# EAGLE design BUS_OUT (EAGLE 9.6.2)
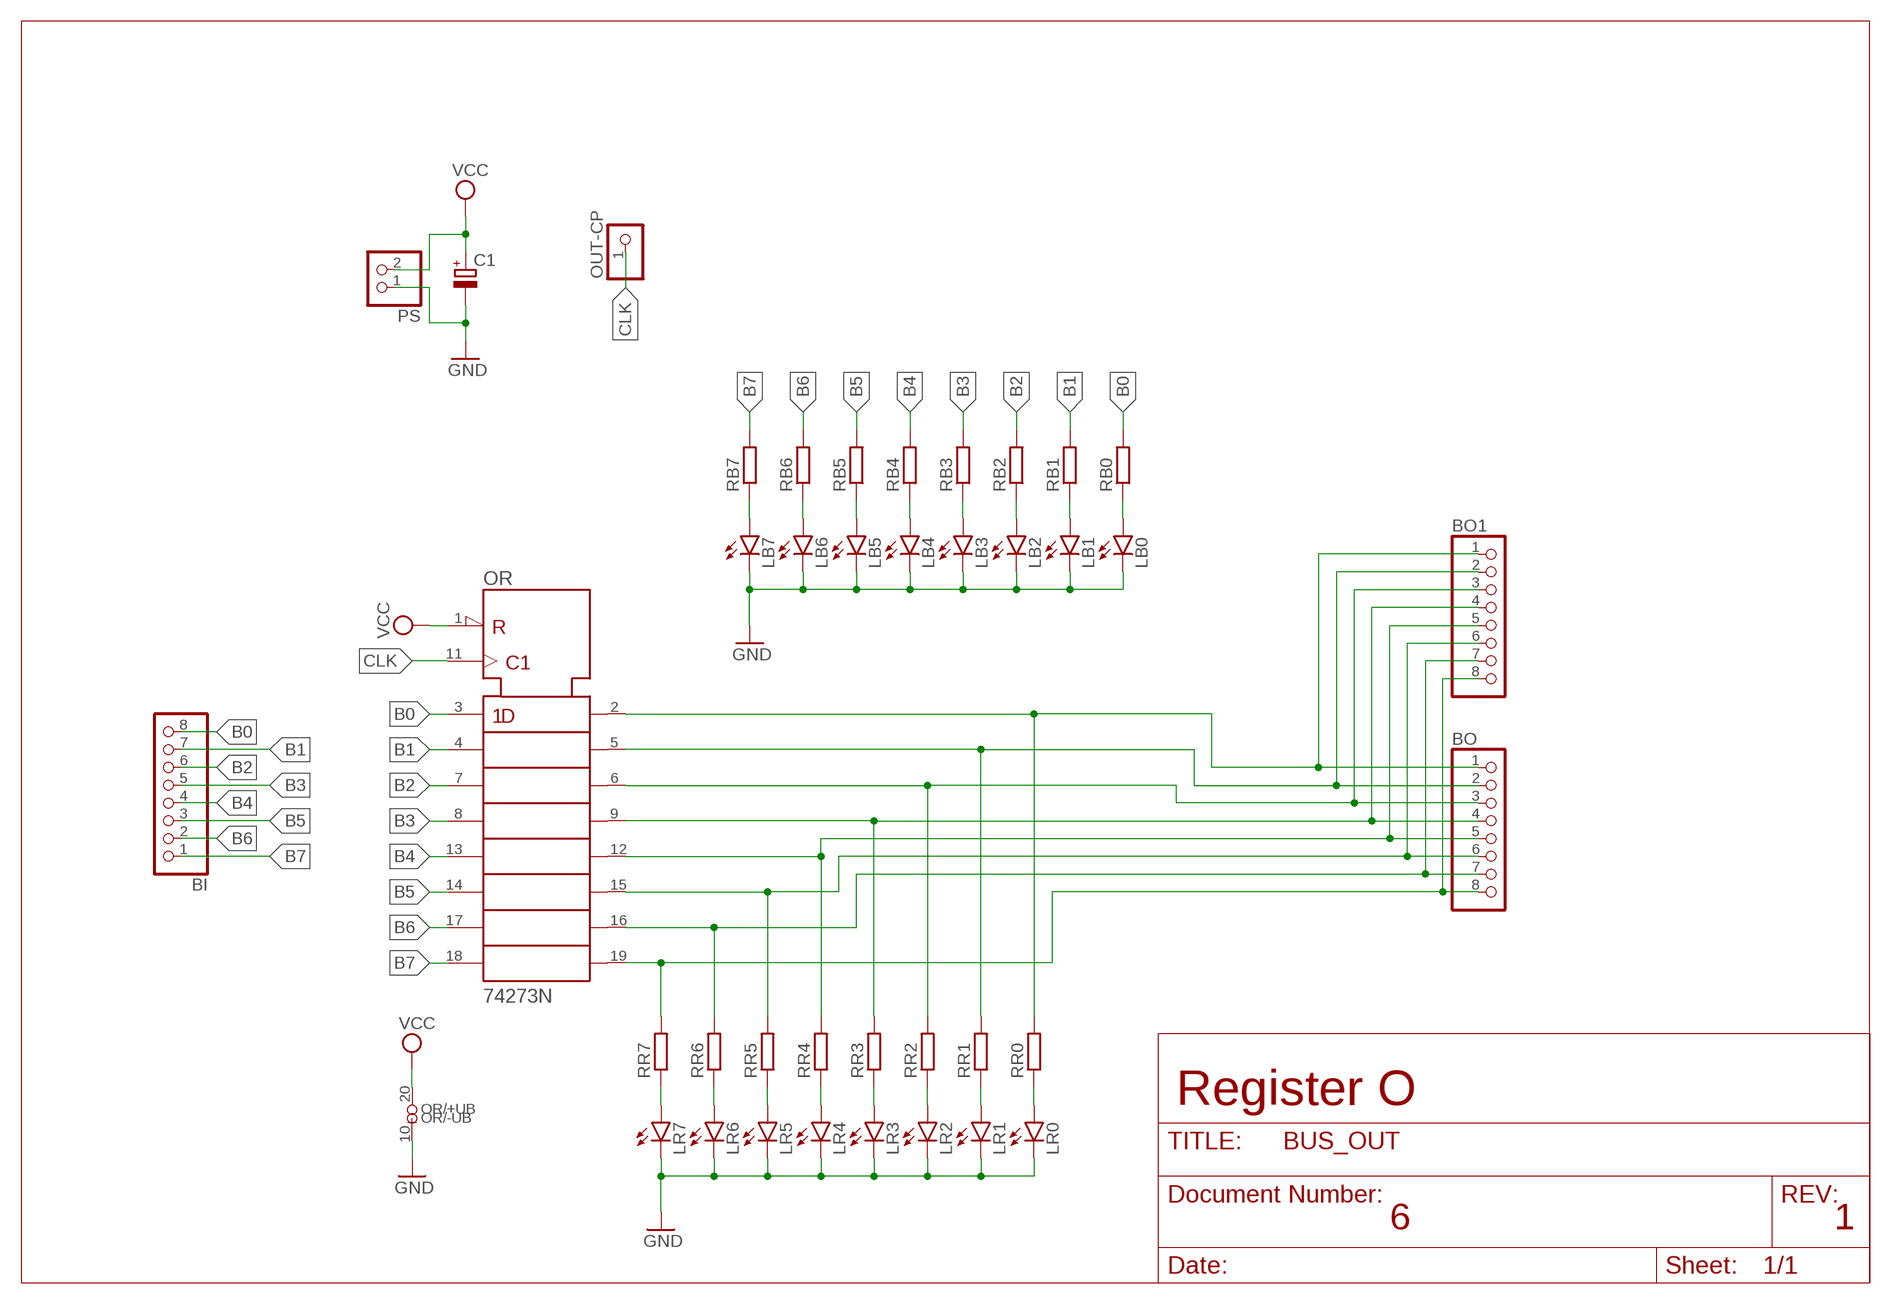
[diagram p0: schematic, sheet 1]

## Parts
BI  PINHD-1X8  [1X08]
BO  PINHD-1X8  [1X08]
BO1  PINHD-1X8  [1X08]
C1  CPOL-EUE2.5-6  [E2,5-6]
LB0  LED5MM  [LED5MM]
LB1  LED5MM  [LED5MM]
LB2  LED5MM  [LED5MM]
LB3  LED5MM  [LED5MM]
LB4  LED5MM  [LED5MM]
LB5  LED5MM  [LED5MM]
LB6  LED5MM  [LED5MM]
LB7  LED5MM  [LED5MM]
LR0  LED5MM  [LED5MM]
LR1  LED5MM  [LED5MM]
LR2  LED5MM  [LED5MM]
LR3  LED5MM  [LED5MM]
LR4  LED5MM  [LED5MM]
LR5  LED5MM  [LED5MM]
LR6  LED5MM  [LED5MM]
LR7  LED5MM  [LED5MM]
OR  74273N  [DIL20]
OUT-CP  PINHD-1X1  [1X01]
PS  PINHD-1X2  [1X02]
RB0  R-EU_0204/7  [0204/7]
RB1  R-EU_0204/7  [0204/7]
RB2  R-EU_0204/7  [0204/7]
RB3  R-EU_0204/7  [0204/7]
RB4  R-EU_0204/7  [0204/7]
RB5  R-EU_0204/7  [0204/7]
RB6  R-EU_0204/7  [0204/7]
RB7  R-EU_0204/7  [0204/7]
RR0  R-EU_0204/7  [0204/7]
RR1  R-EU_0204/7  [0204/7]
RR2  R-EU_0204/7  [0204/7]
RR3  R-EU_0204/7  [0204/7]
RR4  R-EU_0204/7  [0204/7]
RR5  R-EU_0204/7  [0204/7]
RR6  R-EU_0204/7  [0204/7]
RR7  R-EU_0204/7  [0204/7]

## Nets
B0: BI.8 OR.3(1D) RB0.2
B1: BI.7 OR.4(2D) RB1.2
B2: BI.6 OR.7(3D) RB2.2
B3: BI.5 OR.8(4D) RB3.2
B4: BI.4 OR.13(5D) RB4.2
B5: BI.3 OR.14(6D) RB5.2
B6: BI.2 OR.17(7D) RB6.2
B7: BI.1 OR.18(8D) RB7.2
CLK: OR.11(CLK) OUT-CP.1
GND: C1.- LB0.K(C) LB1.K(C) LB2.K(C) LB3.K(C) LB4.K(C) LB5.K(C) LB6.K(C) LB7.K(C) LR0.K(C) LR1.K(C) LR2.K(C) LR3.K(C) LR4.K(C) LR5.K(C) LR6.K(C) LR7.K(C) OR.10(-UB) PS.1
N$1: LB7.A RB7.1
N$3: LB6.A RB6.1
N$5: LB5.A RB5.1
N$7: LB4.A RB4.1
N$9: LR7.A RR7.1
N$10: LB3.A RB3.1
N$11: BO1.8 BO.8 OR.19(8Q) RR7.2
N$12: LR6.A RR6.1
N$14: BO1.7 BO.7 OR.16(7Q) RR6.2
N$15: LR5.A RR5.1
N$16: LB2.A RB2.1
N$17: BO1.6 BO.6 OR.15(6Q) RR5.2
N$18: LR4.A RR4.1
N$20: BO1.5 BO.5 OR.12(5Q) RR4.2
N$21: LR3.A RR3.1
N$22: LB1.A RB1.1
N$23: BO1.4 BO.4 OR.9(4Q) RR3.2
N$24: LR2.A RR2.1
N$26: BO1.3 BO.3 OR.6(3Q) RR2.2
N$27: LR1.A RR1.1
N$28: LB0.A RB0.1
N$29: BO1.2 BO.2 OR.5(2Q) RR1.2
N$30: LR0.A RR0.1
N$32: BO1.1 BO.1 OR.2(1Q) RR0.2
VCC: C1.+ OR.1(!CLR) OR.20(+UB) PS.2

## Notes on the sheet
- Register O
- 6 | 1

## Library data of the parts
BI BO BO1 = pinhead:PINHD-1X8: PIN HEADER
C1 = rcl:CPOL-EU: POLARIZED CAPACITOR, European symbol; SPICEPREFIX: C
LB0 LB1-LB7 LR0 LR1-LR7 = led:LED: LED OSRAM: - CHIPLED LG R971, LG N971, LY N971, LG Q971, LY Q971, LO R971, LY R971 LH N974, LH R974 LS Q976, LO Q976, LY Q976 LO Q996 - Hyper CHIPLED LW Q18S LB Q993, LB Q99A, LB R99A - SideLED LS A670, LO A670, LY A670, LG A670, LP A670 LB A673, LV A673, LT A673, LW A673 LH A674 LY A675 LS A676, LA A676, LO A676, LY A676, LW A676 LS A679, LY A679, LG A679 - Hyper Micro SIDELED® LS Y876, LA Y876, LO Y876, LY Y876 LT Y87S - SmartLED LW L88C, LW L88S LB L89C, LB L89S, LG L890 LS L89K, LO L89K, LY L89K LS L896, LA L896, LO L896, LY L896 - TOPLED LS T670, LO T670, LY T670, LG T670, LP T670 LSG T670, LSP T670, LSY T670, LOP T670, LYG T670 LG T671, LOG T671, LSG T671 LB T673, LV T673, LT T673, LW T673 LH T674 LS T676, LA T676, LO T676, LY T676, LB T676, LH T676, LSB T676, LW T676 LB T67C, LV T67C, LT T67C, LS T67K, LO T67K, LY T67K, LW E67C LS E67B, LA E67B, LO E67B, LY E67B, LB E67C, LV E67C, LT E67C LW T67C LS T679, LY T679, LG T679 LS T770, LO T770, LY T770, LG T770, LP T770 LB T773, LV T773, LT T773, LW T773 LH T774 LS E675, LA E675, LY E675, LS T675 LS T776, LA T776, LO T776, LY T776, LB T776 LHGB T686 LT T68C, LB T68C - Hyper Mini TOPLED® LB M676 - Mini TOPLED Santana® LG M470 LS M47K, LO M47K, LY M47K Source: http://www.osram.convergy.de LUXEON: - LUMILED® LXK2-PW12-R00, LXK2-PW12-S00, LXK2-PW14-U00, LXK2-PW14-V00 LXK2-PM12-R00, LXK2-PM12-S00, LXK2-PM14-U00 LXK2-PE12-Q00, LXK2-PE12-R00, LXK2-PE12-S00, LXK2-PE14-T00, LXK2-PE14-U00 LXK2-PB12-K00, LXK2-PB12-L00, LXK2-PB12-M00, LXK2-PB14-N00, LXK2-PB14-P00, LXK2-PB14-Q00 LXK2-PR12-L00, LXK2-PR12-M00, LXK2-PR14-Q00, LXK2-PR14-R00 LXK2-PD12-Q00, LXK2-PD12-R00, LXK2-PD12-S00 LXK2-PH12-R00, LXK2-PH12-S00 LXK2-PL12-P00, LXK2-PL12-Q00, LXK2-PL12-R00 Source: www.luxeon.com KINGBRIGHT: KA-3528ASYC Source: www.kingbright.com
OR = 74ttl-din:74*273: Octal D type FLIP FLOP, clear
OUT-CP = pinhead:PINHD-1X1: PIN HEADER
PS = pinhead:PINHD-1X2: PIN HEADER
RB0 RB1-RB7 RR0 RR1-RR7 = rcl:R-EU_: RESISTOR, European symbol; SPICEPREFIX: R

## Board
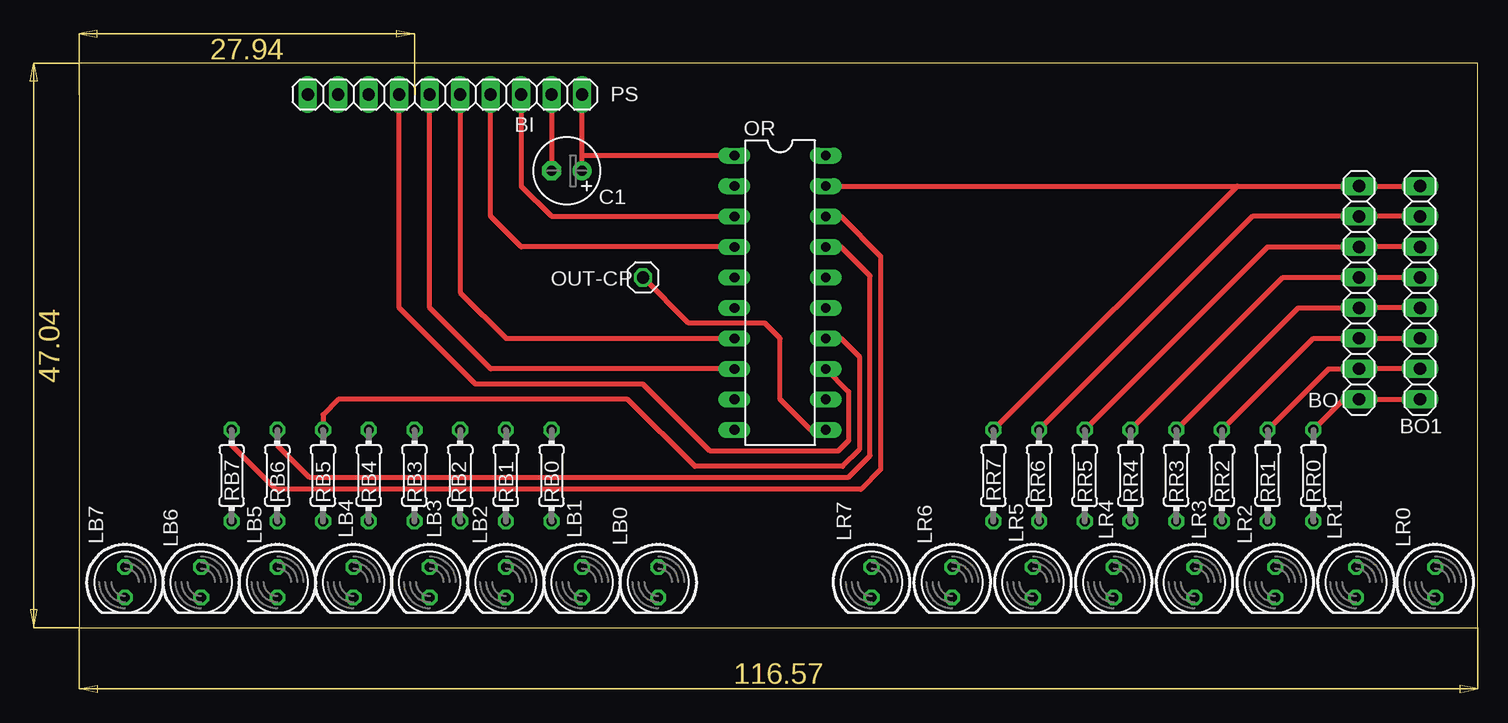
[diagram p1: board, top side]
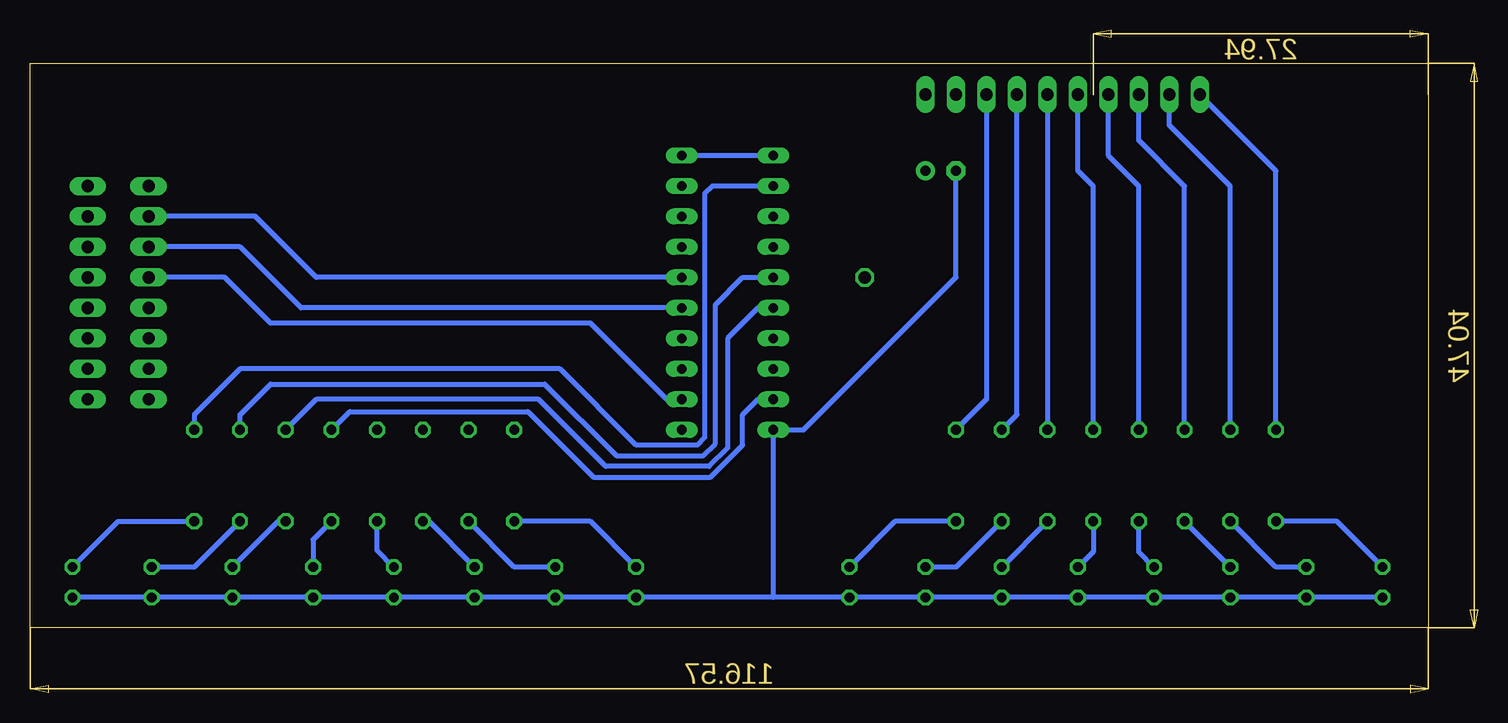
[diagram p2: board, bottom side, seen from below]

Size 116.57 x 47.04 mm. Coordinates in mm from the lower left corner, seen from the top.
Outline: 0,0 116.57,0 116.57,47.04 0,47.04 0,0
Copper layers (1*16): Top 0.035mm / dielectric 1.5mm / Bottom 0.035mm
Design rules "default": minimum track width 6mil, minimum drill 0.35mm, track to track 6mil, track to pad 6mil, pad to pad 6mil, via to via 6mil, smd to smd 6mil, copper to edge 40mil, drill to drill 6mil, minimum pad ring 10mil, minimum via ring 8mil, stop-mask expansion 4mil, vias tented up to drill 0mil, thermal gap 10mil

### Footprints (pad centres in the part's own frame; a part is rotated, then mirrored left to right if it is on the bottom)
1X08 = drill 1.016 long: 1 -8.89,0; 2 -6.35,0; 3 -3.81,0; 4 -1.27,0; 5 1.27,0; 6 3.81,0; 7 6.35,0; 8 8.89,0
E2,5-6 = drill 0.813 pad 1.6: + -1.27,0 | drill 0.813 pad 1.6 octagon: - 1.27,0
LED5MM = drill 0.813 octagon: A -1.27,0; K 1.27,0
DIL20 = drill 0.813 long: 1 -11.43,-3.81; 2 -8.89,-3.81; 3 -6.35,-3.81; 4 -3.81,-3.81; 5 -1.27,-3.81; 6 1.27,-3.81; 7 3.81,-3.81; 8 6.35,-3.81; 9 8.89,-3.81; 10 11.43,-3.81; 11 11.43,3.81; 12 8.89,3.81; 13 6.35,3.81; 14 3.81,3.81; 15 1.27,3.81; 16 -1.27,3.81; 17 -3.81,3.81; 18 -6.35,3.81; 19 -8.89,3.81; 20 -11.43,3.81
1X01 = drill 1.016 octagon: 1 0,0
1X02 = drill 1.016 long: 1 -1.27,0; 2 1.27,0
0204/7 = drill 0.813 octagon: 1 -3.81,0; 2 3.81,0

### Placement (x,y rotation side)
BI  27.94,44.45 0 top
BO  106.68,27.94 90 top
BO1  111.76,27.94 90 top
C1  40.64,38.1 180 top
LB0  48.26,3.81 270 top
LB1  41.91,3.81 270 top
LB2  35.56,3.81 270 top
LB3  29.21,3.81 270 top
LB4  22.86,3.81 270 top
LB5  16.51,3.81 270 top
LB6  10.16,3.81 270 top
LB7  3.81,3.81 270 top
LR0  113.03,3.81 270 top
LR1  106.43,3.81 270 top
LR2  99.69,3.81 270 top
LR3  92.96,3.81 270 top
LR4  86.23,3.81 270 top
LR5  79.5,3.81 270 top
LR6  72.77,3.81 270 top
LR7  66.04,3.81 270 top
OR  58.42,27.94 270 top
OUT-CP  46.99,29.21 0 top
PS  40.64,44.45 0 top
RB0  39.37,12.7 90 top
RB1  35.56,12.7 90 top
RB2  31.75,12.7 90 top
RB3  27.94,12.7 90 top
RB4  24.13,12.7 90 top
RB5  20.32,12.7 90 top
RB6  16.51,12.7 90 top
RB7  12.7,12.7 90 top
RR0  102.87,12.7 90 top
RR1  99.06,12.7 90 top
RR2  95.25,12.7 90 top
RR3  91.44,12.7 90 top
RR4  87.63,12.7 90 top
RR5  83.82,12.7 90 top
RR6  80.01,12.7 90 top
RR7  76.2,12.7 90 top

### Tracks (layer width: path | path; a pad name or v marks a point on that pad's centre or on a via)
B0
  Top 0.4: BI.8 36.83,36.83 39.37,34.29 OR.3
  Bottom 0.4: RB0.2 36.83,19.05 BI.8
B1
  Top 0.4: OR.4 36.83,31.75 34.29,34.29 BI.7
  Bottom 0.4: RB1.2 34.29,17.78 BI.7
B2
  Top 0.4: BI.6 31.75,27.94 35.56,24.13 OR.7
  Bottom 0.4: BI.6 RB2.2
B3
  Top 0.4: OR.8 34.29,21.59 29.21,26.67 BI.5
  Bottom 0.4: RB3.2 27.94,36.83 29.21,38.1 BI.5
B4
  Top 0.4: OR.13 64.14,19.68 64.14,15.62 63.25,14.73 52.58,14.73 46.99,20.32 33.02,20.32 26.67,26.67 BI.4
  Bottom 0.4: RB4.2 24.13,36.83 26.67,39.37 BI.4
B5
  Top 0.4: OR.14 63.5,24.13 65.02,22.61 65.02,14.86 63.63,13.46 51.31,13.46 45.72,19.05 21.59,19.05 20.32,17.78 RB5.2
  Bottom 0.4: RB5.2 20.32,36.83 24.13,40.64 BI.3
B6
  Top 0.4: RB6.2 16.51,15.24 19.18,12.57 64.14,12.57 65.91,14.35 65.91,29.34 63.5,31.75 OR.17
  Bottom 0.4: RB6.2 16.51,36.83 21.59,41.91 BI.2
B7
  Top 0.4: OR.18 63.5,34.29 66.8,30.99 66.8,13.21 65.15,11.56 16.38,11.56 12.7,15.24 RB7.2
  Bottom 0.4: RB7.2 12.7,38.1 BI.1
CLK
  Top 0.4: OR.11 60.96,16.51 58.42,19.05 58.42,24.13 57.15,25.4 50.8,25.4 OUT-CP.1
GND
  Top 0.4: PS.1 C1.-
  Bottom 0.4: LB7.K LB6.K LB5.K LB4.K LB3.K LB2.K LB1.K LB0.K 54.61,2.54 | 54.61,2.54 LR7.K LR6.K LR5.K LR4.K LR3.K LR2.K LR1.K LR0.K | 54.61,2.54 OR.10 52.07,16.51 39.37,29.21 C1.-
N$1
  Bottom 0.4: LB7.A 7.62,8.89 RB7.1
N$3
  Bottom 0.4: LB6.A 12.7,5.08 RB6.1
N$5
  Bottom 0.4: LB5.A RB5.1
N$7
  Bottom 0.4: LB4.A 24.13,6.35 RB4.1
N$9
  Bottom 0.4: LR7.A 69.85,8.89 RR7.1
N$10
  Bottom 0.4: RB3.1 27.94,6.35 LB3.A
N$11
  Top 0.4: RR7.2 96.52,36.83 | 96.52,36.83 BO.8 BO1.8 | OR.19 96.52,36.83
N$12
  Bottom 0.4: LR6.A 76.2,5.08 RR6.1
N$14
  Top 0.4: RR6.2 97.79,34.29 BO.7 BO1.7
  Bottom 0.4: BO.7 97.79,34.29 92.71,29.21 OR.16
N$15
  Bottom 0.4: LR5.A 83.31,8.89 RR5.1
N$16
  Bottom 0.4: RB2.1 LB2.A
N$17
  Top 0.4: RR5.2 99.06,31.75 BO.6 BO1.6
  Bottom 0.4: OR.15 93.98,26.67 99.06,31.75 BO.6
N$18
  Bottom 0.4: LR4.A 87.63,6.48 RR4.1
N$20
  Top 0.4: RR4.2 100.33,29.21 BO.5 BO1.5
  Bottom 0.4: OR.12 63.5,19.05 69.85,25.4 96.52,25.4 100.33,29.21 BO.5
N$21
  Bottom 0.4: RR3.1 92.96,7.37 LR3.A
N$22
  Bottom 0.4: RB1.1 39.37,5.08 LB1.A
N$23
  Top 0.4: RR3.2 101.6,26.67 BO.4 BO1.4
  Bottom 0.4: OR.9 55.88,19.05 57.15,17.78 57.15,15.24 59.82,12.57 69.6,12.57 75.06,18.03 89.92,18.03 RR3.2
N$24
  Bottom 0.4: LR2.A 95.89,8.89 RR2.1
N$26
  Top 0.4: RR2.2 102.87,24.13 BO.3 BO1.3
  Bottom 0.4: OR.6 55.88,26.67 58.42,24.13 58.42,14.99 59.94,13.46 68.58,13.46 74.17,19.05 92.71,19.05 RR2.2
N$27
  Bottom 0.4: RR1.1 102.87,5.08 LR1.A
N$28
  Bottom 0.4: RB0.1 44.45,8.89 LB0.A
N$29
  Top 0.4: RR1.2 104.14,21.59 BO.2 BO1.2
  Bottom 0.4: RR1.2 99.06,17.78 96.52,20.32 73.66,20.32 67.69,14.35 60.45,14.35 59.44,15.37 59.44,26.92 57.15,29.21 OR.5
N$30
  Bottom 0.4: LR0.A 109.22,8.89 RR0.1
N$32
  Top 0.4: RR0.2 105.41,19.05 BO.1 BO1.1
  Bottom 0.4: RR0.2 102.87,17.78 99.06,21.59 72.39,21.59 66.04,15.24 60.96,15.24 60.33,15.88 60.33,36.2 59.69,36.83 OR.2
VCC
  Top 0.4: C1.+ 41.91,39.37 | 41.91,39.37 PS.2 | OR.1 41.91,39.37
  Bottom 0.4: OR.1 OR.20